# Altium schematic sheet GuitarPreamp1.SchDoc: Guitar Preamp #1
size A; DrawnBy: CLB; Engineer: CLB; DocumentNumber: 300-001; Revision: 1; SheetNumber: 1; SheetTotal: 1
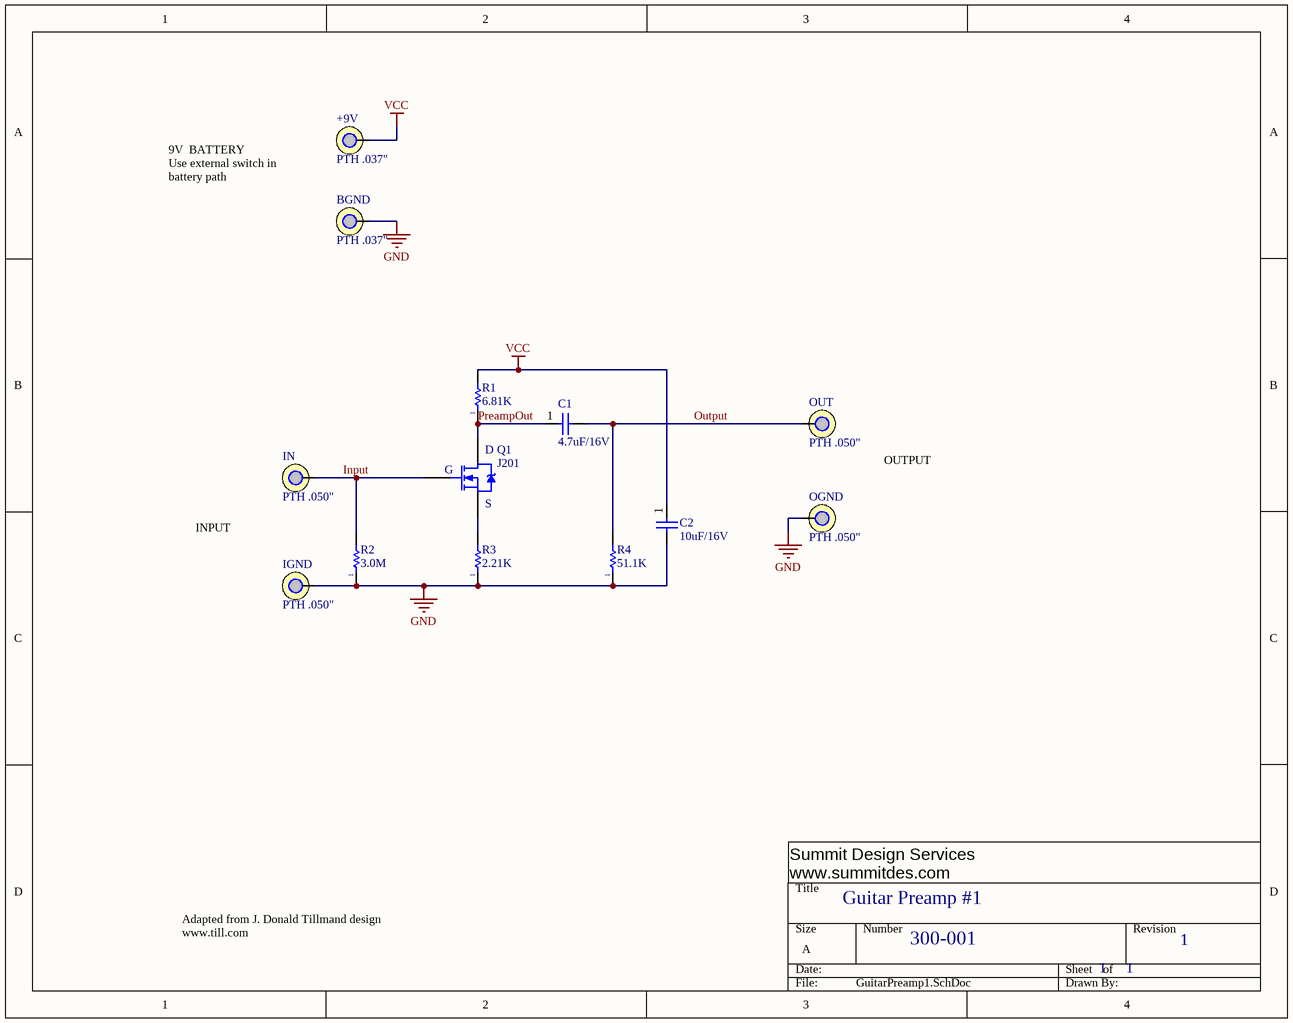
[diagram p0: GuitarPreamp1.SchDoc]

## Parts
+9V  (no value)  [PTH_037]
BGND  (no value)  [PTH_037]
C1  Display Value: 4.7uF/16V  [0805C]
C2  Display Value: 10uF/16V  [1206C]
IGND  (no value)  [PTH_050]
IN  (no value)  [PTH_050]
OGND  (no value)  [PTH_050]
OUT  (no value)  [PTH_050]
Q1  Display Value: J201  [SOT23-3-A]
R1  Display Value: 6.81K  [0805R]
R2  Display Value: 3.0M  [0805R]
R3  Display Value: 2.21K  [0805R]
R4  Display Value: 51.1K  [0805R]

## Nets
GND: BGND.1 C2.2 IGND.1 OGND.1 R2.1 R3.1 R4.1
VCC: +9V.1 C2.1 R1.2
Input: IN.1 Q1.G R2.2
Output: C1.2 OUT.1 R4.2
PreampOut: C1.1 Q1.D R1.1
NetQ1_S: Q1.S R3.2

## Notes on the sheet
- 9V  BATTERY
  Use external switch in battery path
- OUTPUT
- INPUT
- Summit Design Services
  www.summitdes.com
- Adapted from J. Donald Tillmand design
  www.till.com

## Library data of the parts
+9V BGND = 250-002: PTH .037"; Class: Connector; Designator: J; Value: *; Manufacturer: *; Manufacturer P/N: *; Supplier 1: *; Supplier Part Number 1: *; Supplier 2: *; Supplier Part Number 2: *; helpURL: *; Datasheet: *; Inventory: *; Display Value: PTH .037"; Part Number: 250-002; Pin Count: 1; Component Type: Standard; Component Kind: Standard
C1 = 200-003: 4.7UF 16V Y5V 0805; Manufacturer: TDK; Manufacturer P/N: C2012Y5V1C475Z/0.85; Designator: C?; Class: Capacitor; Inventory: 0; POPULATE: Y; Part Number: 200-003; Value: 4.7uF; Voltage: 16V; Datasheet: http://www.tdk.com/pdf/general_B11.pdf; helpURL: http://www.tdk.com/pdf/general_B11.pdf; Supplier 1: digi-key; Supplier 1 P/N: 445-3460-1-ND; RoHS: Y; Component Type: Standard; Component Kind: Standard; Pin Count: 2
C2 = 200-002: 10UF 16V Y5V 1206; Manufacturer: Murata; Manufacturer P/N: GRM31MF51C106ZA12L; Designator: C?; Class: Capacitor; Inventory: 0; POPULATE: Y; Part Number: 200-002; Value: 10uF; Voltage: 16V; Datasheet: http://search.murata.co.jp/Ceramy/image/img/PDF/ENG/GRM31MF51C106ZA12.pdf; helpURL: http://search.murata.co.jp/Ceramy/image/img/PDF/ENG/GRM31MF51C106ZA12.pdf; Supplier 1: digi-key; Supplier 1 P/N: 490-3383-1-ND; RoHS: Y; Component Type: Standard; Component Kind: Standard; Pin Count: 2
IGND IN OGND OUT = 250-003: PTH .050"; Class: Connector; Designator: J; Value: *; Manufacturer: *; Manufacturer P/N: *; Supplier 1: *; Supplier Part Number 1: *; Supplier 2: *; Supplier Part Number 2: *; helpURL: *; Datasheet: *; Inventory: *; Display Value: PTH .050"; Part Number: 250-003; Pin Count: 1; Component Type: Standard; Component Kind: Standard
Q1 = 230-001: IC SWITCH N-CH 40V 50MA SOT-23; Manufacturer: Fairchild; Manufacturer P/N: MMBFJ201; Class: Transistor; Inventory: 0; VDG: 40; Designator: Q; POPULATE: Y; Value: *; Datasheet: http://www.fairchildsemi.com/ds/MM%2FMMBFJ201.pdf; Mouser P/N: *; helpURL: http://www.fairchildsemi.com/ds/MM%2FMMBFJ201.pdf; Supplier 1: digi-key; Supplier Part Number 1: *; Supplier 2: *; Supplier Part Number 2: *; Mouser Price: *; Part Number: 230-001; I: 50mA; Supplier 1 P/N: MMBFJ201CT-ND; RoHS: Y; Component Type: Standard; Component Kind: Standard; Pin Count: 3
R1 = 210-002: RES 6.81K OHM 1/8W 1% 0805; Manufacturer: Panasonic; Manufacturer P/N: ERJ-6ENF6811V; Class: Resistor; Tol: 0.01; Designator: R?; Inventory: 0; POPULATE: Y; Value: 6.81K; Part Number: 210-002; Power: 1/8W; Datasheet: http://industrial.panasonic.com/www-cgi/jvcr13pz.cgi?E+PZ+3+AOA0002+ERJ6ENF6811V+7+WW; helpURL: http://industrial.panasonic.com/www-cgi/jvcr13pz.cgi?E+PZ+3+AOA0002+ERJ6ENF6811V+7+WW; Supplier 1: digi-key; Supplier 1 P/N: P6.81KCTR-ND; RoHS: Y; Component Type: Standard; Component Kind: Standard; Pin Count: 2
R2 = 210-005: RES 3.0M OHM 1/8W 5% 0805; Manufacturer: Panasonic; Manufacturer P/N: ERJ-6GEYJ305V; Class: Resistor; Tol: 0.05; Designator: R?; Inventory: 0; POPULATE: Y; Value: 3.0M; Part Number: 210-005; Power: 1/8W; Datasheet: http://industrial.panasonic.com/www-cgi/jvcr13pz.cgi?E+PZ+3+AOA0002+ERJ6ENF6811V+7+WW; helpURL: http://industrial.panasonic.com/www-cgi/jvcr13pz.cgi?E+PZ+3+AOA0002+ERJ6ENF6811V+7+WW; Supplier 1: digi-key; Supplier 1 P/N: P3.0MACT-ND; RoHS: Y; Component Type: Standard; Component Kind: Standard; Pin Count: 2
R3 = 210-003: RES 2.21K OHM 1/8W 1% 0805; Manufacturer: Panasonic; Manufacturer P/N: ERJ-6ENF2211V; Class: Resistor; Tol: 0.01; Designator: R?; Inventory: 0; POPULATE: Y; Value: 2.21K; Part Number: 210-003; Power: 1/8W; Datasheet: http://industrial.panasonic.com/www-cgi/jvcr13pz.cgi?E+PZ+3+AOA0002+ERJ6ENF6811V+7+WW; helpURL: http://industrial.panasonic.com/www-cgi/jvcr13pz.cgi?E+PZ+3+AOA0002+ERJ6ENF6811V+7+WW; Supplier 1: digi-key; Supplier 1 P/N: P2.21KCTR-ND; RoHS: Y; Component Type: Standard; Component Kind: Standard; Pin Count: 2
R4 = 210-004: RES 51.1K OHM 1/8W 1% 0805; Manufacturer: Panasonic; Manufacturer P/N: ERJ-6ENF5112V; Class: Resistor; Tol: 0.01; Designator: R?; Inventory: 0; POPULATE: Y; Value: 51.1K; Part Number: 210-004; Power: 1/8W; Datasheet: http://industrial.panasonic.com/www-cgi/jvcr13pz.cgi?E+PZ+3+AOA0002+ERJ6ENF6811V+7+WW; helpURL: http://industrial.panasonic.com/www-cgi/jvcr13pz.cgi?E+PZ+3+AOA0002+ERJ6ENF6811V+7+WW; Supplier 1: digi-key; Supplier 1 P/N: P51.1KCCT-ND; RoHS: Y; Component Type: Standard; Component Kind: Standard; Pin Count: 2